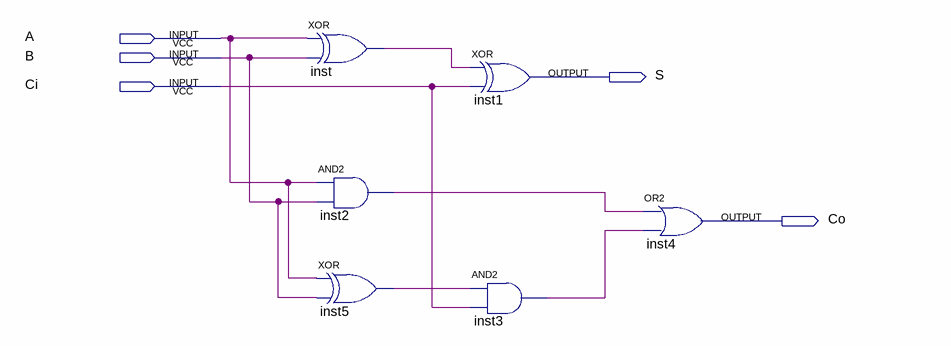
[diagram p0: schematic sheet]
// Quartus schematic adder.bdf as structural Verilog: 6 symbols, 5 pins
module adder (
  input  A,
  input  B,
  input  Ci,
  output S,
  output Co
);

  wire inst2_out, inst3_out, inst5_out, inst_out;

  xor inst (inst_out, A, B);
  and inst2 (inst2_out, A, B);
  xor inst5 (inst5_out, A, B);
  xor inst1 (S, inst_out, Ci);
  and inst3 (inst3_out, inst5_out, Ci);
  or inst4 (Co, inst2_out, inst3_out);
endmodule
